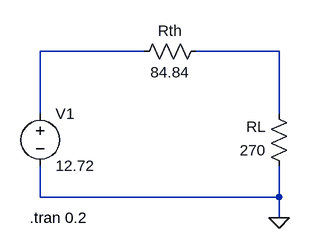
[diagram p0: schematic Thevenin3.asc]
Thevenin3.asc, the LTspice schematic file:
Version 4
SHEET 1 880 680
WIRE 336 224 176 224
WIRE 544 224 416 224
WIRE 176 320 176 224
WIRE 544 320 544 224
WIRE 176 448 176 400
WIRE 544 448 544 400
WIRE 544 448 176 448
WIRE 544 480 544 448
FLAG 544 480 0
SYMBOL voltage 176 304 R0
SYMATTR InstName V1
SYMATTR Value 12.72
SYMBOL Res 432 208 R90
WINDOW 0 0 56 VBottom 2
WINDOW 3 32 56 VTop 2
SYMATTR InstName Rth
SYMATTR Value 84.84
SYMBOL Res 560 416 R180
WINDOW 0 36 76 Left 2
WINDOW 3 36 40 Left 2
SYMATTR InstName RL
SYMATTR Value 270
TEXT 160 480 Left 2 !.tran 0.2

The netlist it stands for:
* Thevenin3.asc
V1 N001 0 12.72
Rth N002 N001 84.84
RL 0 N002 270
.tran 0.2
.backanno
.end